# EAGLE design PickupBoard (EAGLE 7.4.0)
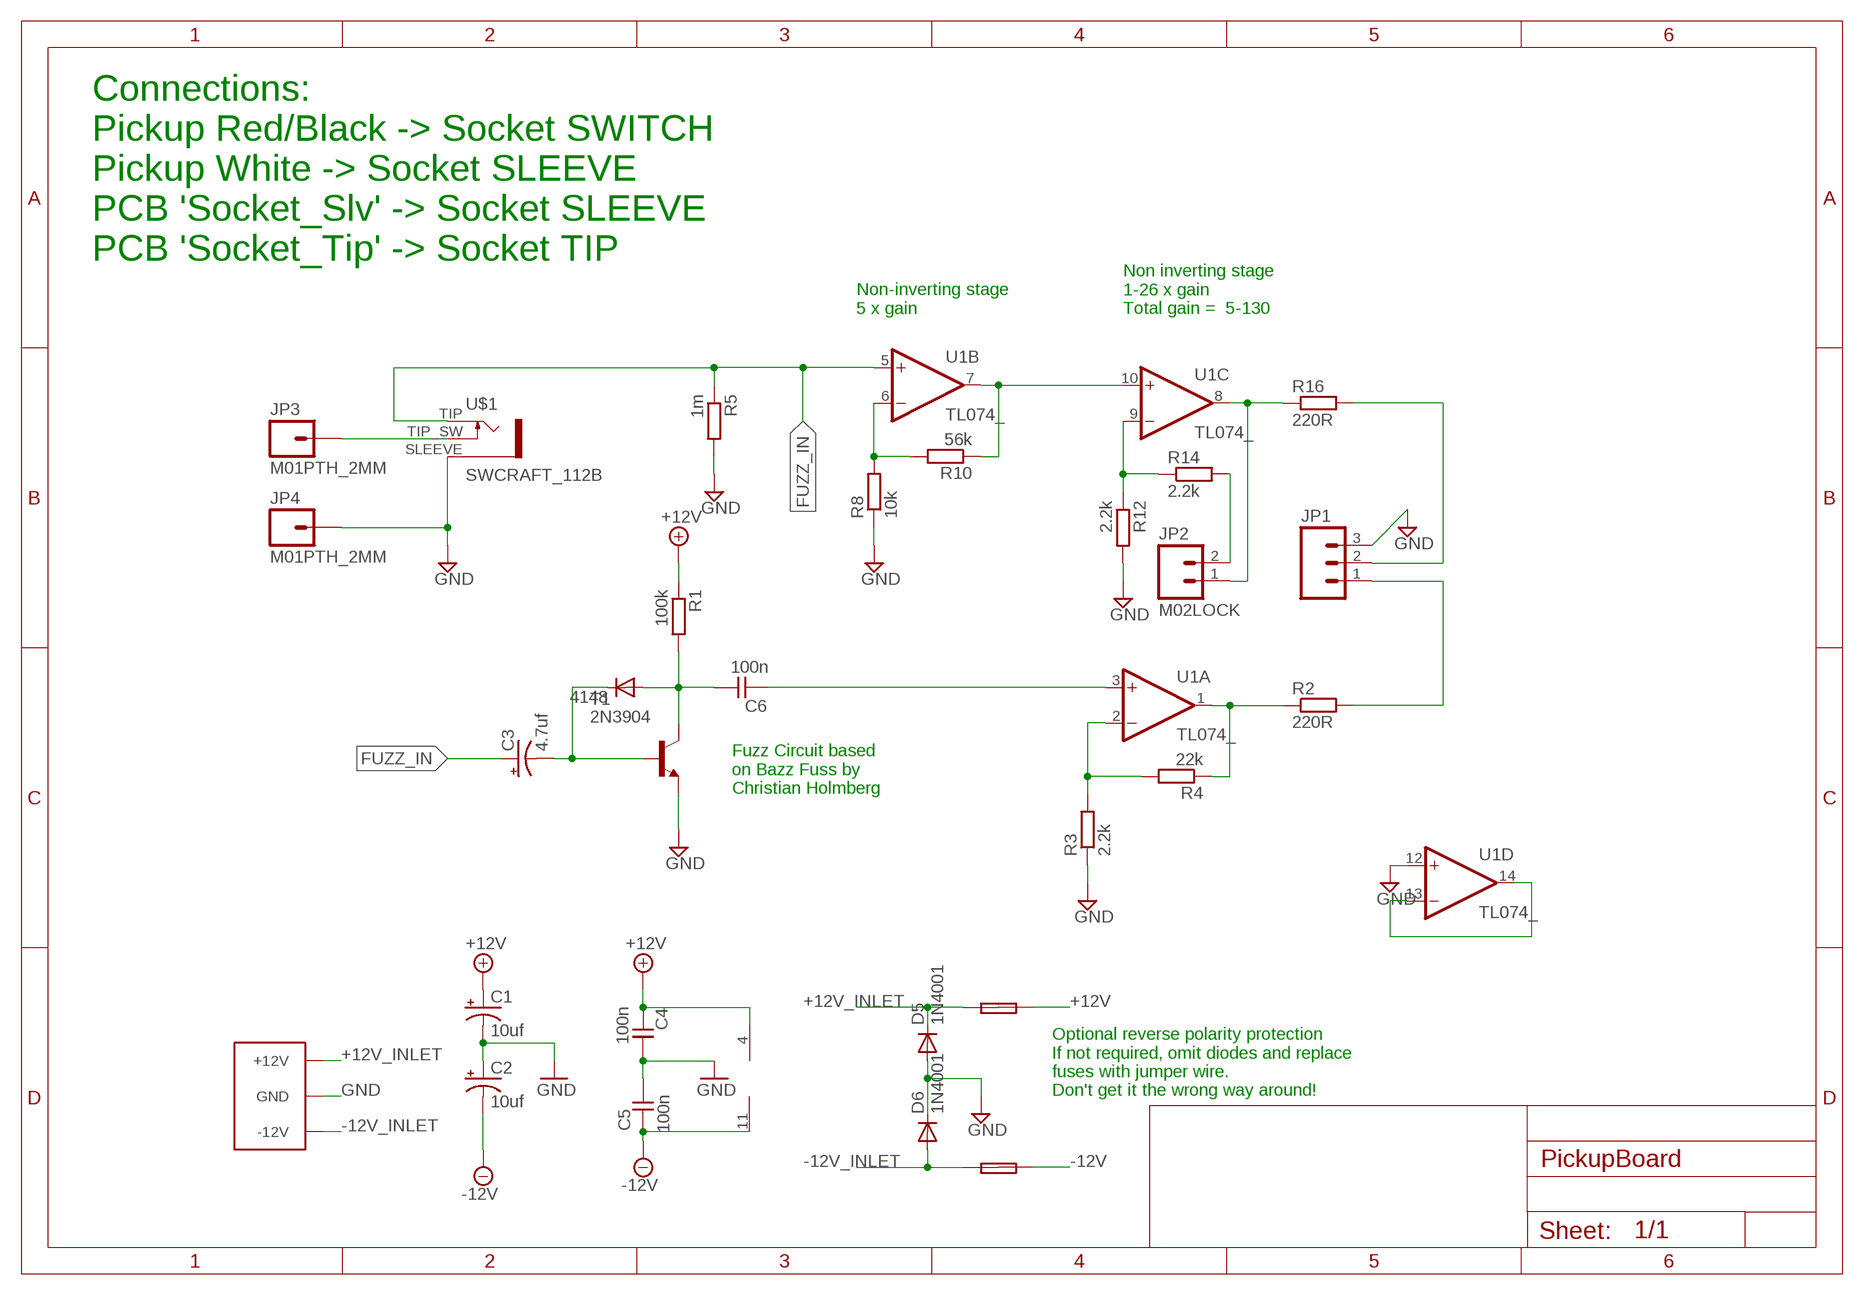
[diagram p0: schematic, sheet 1]

## Parts
1  FUSE  PTC_FUSEPOLY_FUSE  [C050H075X075]
4148  SMALL_DIODEDO35-7  [DO35-7]
C1  10uf  CAP_POLPTH2  [CPOL-RADIAL-10UF-25V]
C2  10uf  CAP_POLPTH2  [CPOL-RADIAL-10UF-25V]
C3  4.7uf  CAP_POLPTH2  [CPOL-RADIAL-10UF-25V]
C4  100n  C-EU050-024X044  [C050-024X044]
C5  100n  C-EU050-024X044  [C050-024X044]
C6  100n  C-EU050-024X044  [C050-024X044]
D5  1N4001  1N4004  [DO41-10]
D6  1N4001  1N4004  [DO41-10]
FUSE  FUSE  PTC_FUSEPOLY_FUSE  [C050H075X075]
JP1  M03LOCK  [1X03_LOCK]
JP2  M02LOCK  [1X02_LOCK]
JP3  M01PTH_2MM  [1X01_2MM]
JP4  M01PTH_2MM  [1X01_2MM]
R1  100k  RESISTOR7MM  [7MM_RESISTOR]
R2  220R  RESISTOR7MM  [7MM_RESISTOR]
R3  2.2k  RESISTOR7MM  [7MM_RESISTOR]
R4  22k  RESISTOR7MM  [7MM_RESISTOR]
R5  1m  RESISTOR7MM  [7MM_RESISTOR]
R8  10k  RESISTOR7MM  [7MM_RESISTOR]
R10  56k  RESISTOR7MM  [7MM_RESISTOR]
R12  2.2k  RESISTOR7MM  [7MM_RESISTOR]
R14  2.2k  RESISTOR7MM  [7MM_RESISTOR]
R16  220R  RESISTOR7MM  [7MM_RESISTOR]
T1  2N3904  [TO92]
U1  TL074_  [DIL14]
U$1  SWCRAFT_112B  [SWCRAFT_112_SLOTS]
U$2  EURO_POWER_LOCK  [EURO_PWR_HEADER_LOCK]

## Nets
+12V [power]: 1.2 C1.1(+) C4.2 R1.1 U1.4(P:V+)
+12V_INLET: 1.1 D5.C U$2.POS1(+12V) U$2.POS2(+12V)
-12V [power]: C2.2(-) C5.2 FUSE.2 U1.11(P:V-)
-12V_INLET: D6.A FUSE.1 U$2.NEG1(-12V) U$2.NEG2(-12V)
FUZZ_IN: C3.1(+) R5.1 U1.5(B:+IN) U$1.TIP
GND [ground]: C1.2(-) C2.1(+) C4.1 C5.1 D5.A D6.C JP1.3 JP4.1 R3.1 R5.2 R8.1 R12.2 T1.3(E) U1.12(D:+IN) U$1.SLEEVE U$2.GND1(GND) U$2.GND2(GND) U$2.GND3(GND) U$2.GND4(GND) U$2.GND5(GND) U$2.GND6(GND)
N$1: C6.2 U1.3(A:+IN)
N$2: U1.13(D:-IN) U1.14(D:OUT)
N$3: R8.2 R10.2 U1.6(B:-IN)
N$4: R10.1 U1.7(B:OUT) U1.10(C:+IN)
N$5: JP2.2 R14.2
N$6: R12.1 R14.1 U1.9(C:-IN)
N$7: 4148.C C3.2(-) T1.2(B)
N$8: JP2.1 R16.1 U1.8(C:OUT)
N$9: 4148.A C6.1 R1.2 T1.1(C)
N$10: JP1.2 R16.2
N$11: R3.2 R4.2 U1.2(A:-IN)
N$12: R2.1 R4.1 U1.1(A:OUT)
N$13: JP1.1 R2.2
N$14: JP3.1 U$1.TIP_SW

## Notes on the sheet
- Connections:
  Pickup Red/Black -> Socket SWITCH
  Pickup White -> Socket SLEEVE
  PCB 'Socket_Slv' -> Socket SLEEVE
  PCB 'Socket_Tip' -> Socket TIP
- Non-inverting stage
  5 x gain
- Non inverting stage
  1-26 x gain
  Total gain =  5-130
- Fuzz Circuit based 
  on Bazz Fuss by 
  Christian Holmberg
- Optional reverse polarity protection
  If not required, omit diodes and replace
  fuses with jumper wire. 
  Don't get it the wrong way around!

## Library data of the parts
1 FUSE = TomW:PTC_FUSE
4148 = MusicThingModular:SMALL_DIODE: Small Signal Diode
C1-C3 = SparkFun-Passives:CAP_POL: Capacitor Polarized These are standard SMD and PTH capacitors. Normally 10uF, 47uF, and 100uF in electrolytic and tantalum varieties. Always verify the external diameter of the through hole cap, it varies with capacity, voltage, and manufacturer. The EIA devices should be standard.
C4-C6 = TomW:C-EU: CAPACITOR, European symbol
D5 D6 = diode:1N4004: DIODE general purpose rectifier, 1 A
JP1 = SparkFun-Connectors:M03: Header 3 Standard 3-pin 0.1" header. Use with straight break away headers (SKU : PRT-00116), right angle break away headers (PRT-00553), swiss pins (PRT-00743), machine pins (PRT-00117), and female headers (PRT-00115). Molex polarized connector foot print use with SKU : PRT-08232 with associated crimp pins and housings.
JP2 = SparkFun-Connectors:M02: Standard 2-pin 0.1" header. Use with - straight break away headers ( PRT-00116) - right angle break away headers (PRT-00553) - swiss pins (PRT-00743) - machine pins (PRT-00117) - female headers (PRT-00115) Molex polarized connector foot print use with: PRT-08233 with associated crimp pins and housings. 2.54_SCREWTERM for use with PRT-10571. 3.5mm Screw Terminal footprints for PRT-08084 5mm Screw Terminal footprints for use with PRT-08433
JP3 JP4 = SparkFun-Connectors:M01: Header 1 Standard 1-pin 0.1" header. Use with straight break away headers (SKU : PRT-00116), right angle break away headers (PRT-00553), swiss pins (PRT-00743), machine pins (PRT-00117), and female headers (PRT-00115).
R1-R5 R8 R10 R12 R14 R16 = MusicThingModular:RESISTOR: Standard resistor, various versions
T1 = transistor:2N3904: NPN TRANSISTOR
U1 = MusicThingModular:TL074: Generic Quad Op Amp
U$1 = TomW:SWCRAFT_112B
U$2 = MusicThingModular:EURO_POWER_LOCK

## Net classes
0 default: width 0.254 mm
1 power: width 0.254 mm
2 ground: width 0.254 mm

## Board
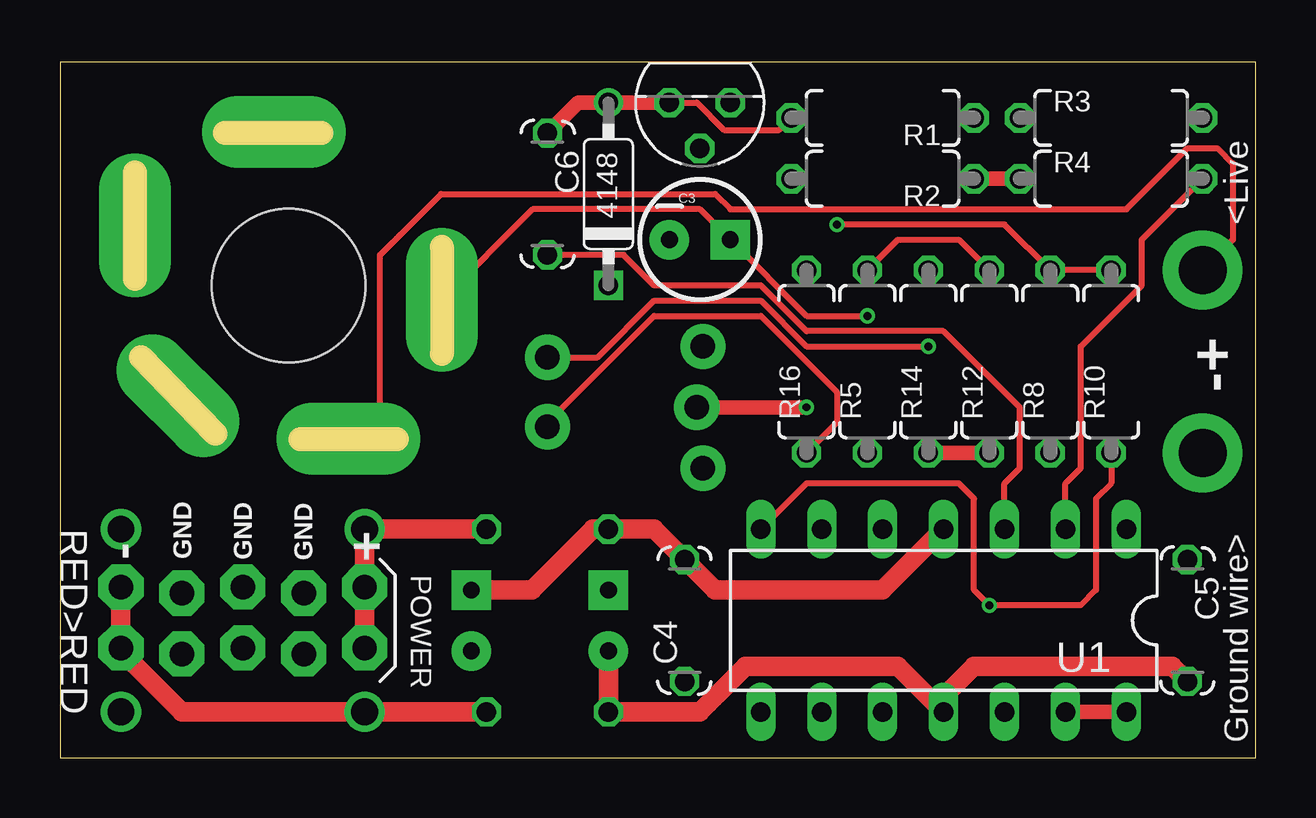
[diagram p1: board, top side]
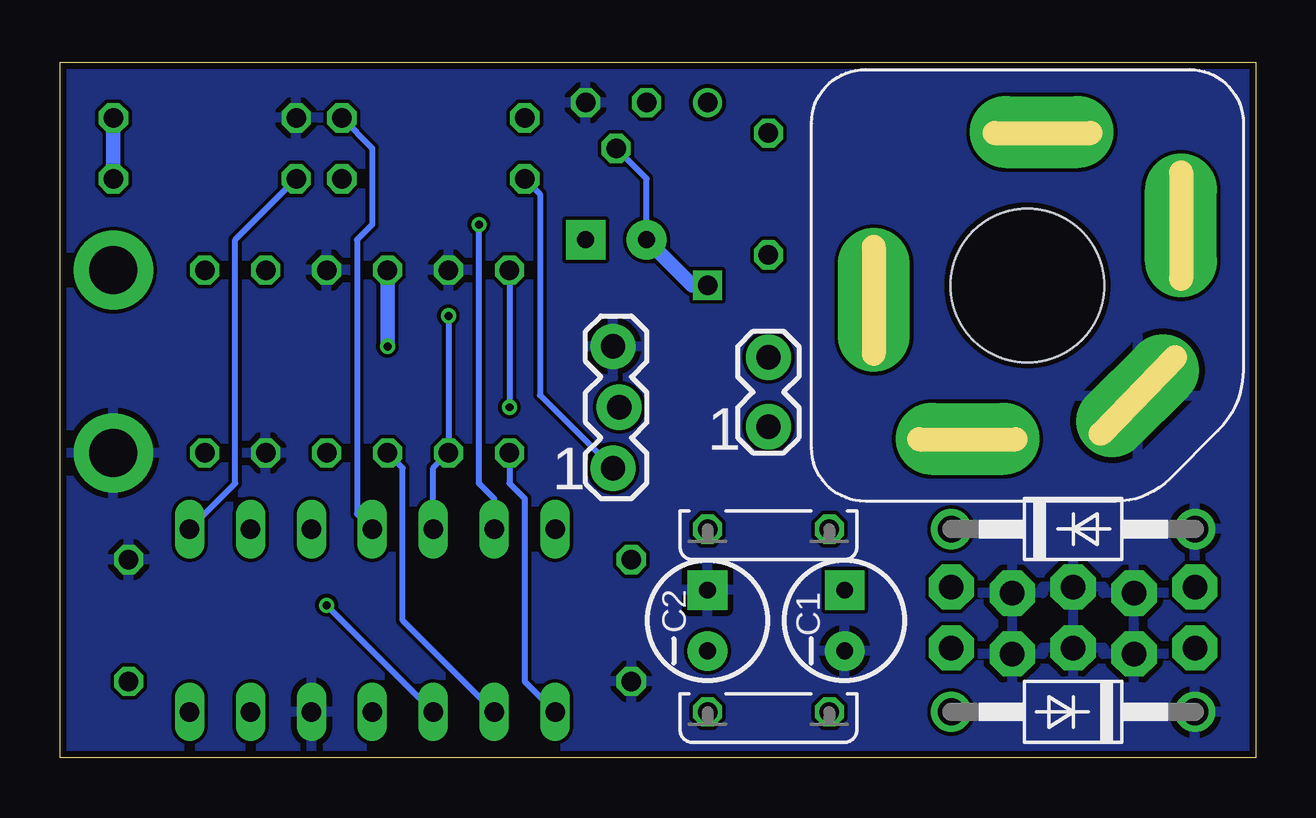
[diagram p2: board, bottom side, seen from below]

Size 49.85 x 29 mm. Coordinates in mm from the lower left corner, seen from the top.
Outline: 0,0 49.85,0 49.85,29 0,29 0,0
Copper layers (1*2*15*16): Top 0.035mm / dielectric 0.2mm / Route2 0.0175mm / dielectric 1.1mm / Route15 0.0175mm / dielectric 0.2mm / Bottom 0.035mm
Design rules "SeeedStudio_DRU_no_angle_20130527": minimum track width 6mil, minimum drill 12mil, track to track 6mil, track to pad 6mil, pad to pad 6mil, via to via 6mil, smd to smd 0mil, copper to edge 10mil, drill to drill 10mil, minimum pad ring 6mil, minimum via ring 6mil, stop-mask expansion 2mil, vias tented up to drill 25mil, thermal gap 10mil

### Footprints (pad centres in the part's own frame; a part is rotated, then mirrored left to right if it is on the bottom)
C050H075X075 = drill 0.813 octagon: 1 -2.54,0; 2 2.54,0
DO35-7 = drill 0.813: A 3.81,0 | drill 0.813 square: C -3.81,0
CPOL-RADIAL-10UF-25V = drill 0.7 pad 1.651 square: 1 1.27,0 | drill 0.7 pad 1.651: 2 -1.27,0
C050-024X044 = drill 0.813 octagon: 1 -2.54,0; 2 2.54,0
DO41-10 = drill 1.118: A 5.08,0; C -5.08,0
1X03_LOCK = drill 1.016 pad 1.88: 1 0,0.127; 2 2.54,-0.127; 3 5.08,0.127
1X02_LOCK = drill 1.016 pad 1.88: 1 -0.178,0; 2 2.718,0
1X01_2MM = drill 2 pad 3.302: 1 0,0
7MM_RESISTOR = drill 0.813 octagon: 1 -3.81,0; 2 3.81,0
TO92 = drill 0.813 octagon: 1 1.27,0; 2 0,1.905; 3 -1.27,0
DIL14 = drill 0.813 long: 1 -7.62,-3.81; 2 -5.08,-3.81; 3 -2.54,-3.81; 4 0,-3.81; 5 2.54,-3.81; 6 5.08,-3.81; 7 7.62,-3.81; 8 7.62,3.81; 9 5.08,3.81; 10 2.54,3.81; 11 0,3.81; 12 -2.54,3.81; 13 -5.08,3.81; 14 -7.62,3.81
SWCRAFT_112_SLOTS = drill 0.45 pad 3 long: RING 0.6,6.4; RING_SW 6.4,2.5; SLEEVE 4.6,-4.6; TIP -6.4,-0.6; TIP_SW -2.5,-6.4 | hole 6.4: 0,0
EURO_PWR_HEADER_LOCK = drill 1.016 pad 1.88 octagon: GND1 -2.54,1.143; GND2 -2.54,-1.397; GND3 0,1.397; GND4 0,-1.143; GND5 2.54,1.143; GND6 2.54,-1.397; NEG1 -5.08,1.397; NEG2 -5.08,-1.143; POS1 5.08,1.397; POS2 5.08,-1.143

### Placement (x,y rotation side)
1  20.32,9.53 180 bottom
4148  22.86,23.5 90 top
C1  17.14,5.71 90 bottom
C2  22.86,5.71 90 bottom
C3  26.67,21.59 0 top
C4  26.04,5.71 90 top
C5  46.99,5.71 270 top
C6  20.32,23.5 270 top
D5  7.62,9.53 0 bottom
D6  7.62,1.91 180 bottom
FUSE  20.32,1.91 180 bottom
JP1  26.67,12.06 90 bottom
JP2  20.32,13.97 90 bottom
JP3  47.62,20.32 0 top
JP4  47.62,12.7 0 top
R1  34.29,26.67 180 top
R2  34.29,24.13 180 top
R3  43.81,26.67 0 top
R4  43.81,24.13 0 top
R5  33.66,16.51 90 top
R8  41.27,16.51 90 top
R10  43.81,16.51 90 top
R12  38.73,16.51 90 top
R14  36.2,16.51 90 top
R16  31.11,16.51 90 top
T1  26.67,27.3 180 top
U1  36.83,5.71 180 top
U$1  9.53,19.68 0 bottom
U$2  7.62,5.71 0 top

### Tracks (layer width: path | path; a pad name or v marks a point on that pad's centre or on a via)
+12V
  Top 0.813: C1.1 19.68,6.99 22.23,9.53 1.2 24.77,9.53 C4.2 27.3,6.99 34.29,6.99 U1.4
  Bottom 0.254: R1.1 36.83,25.4 36.83,22.23 37.47,21.59 37.47,10.16 U1.4
+12V_INLET
  Top 0.813: U$2.POS2 U$2.POS1 D5.C 1.1
-12V
  Top 0.813: C2.2 FUSE.2 26.67,1.91 28.57,3.81 34.92,3.81 U1.11 36.83,2.54 38.1,3.81 46.35,3.81 C5.2
-12V_INLET
  Top 0.813: U$2.NEG1 U$2.NEG2 2.54,4.45 5.08,1.91 D6.A FUSE.1
FUZZ_IN  (via drill 0.33)
  Top 0.254: U$1.TIP 19.7,22.86 26.67,22.86 C3.1 31.11,18.41 v33.66,18.41
  Bottom 0.254: U1.5 34.29,12.06 R5.1 v33.66,18.41
GND
  Top 0.254: R5.2 34.92,21.59 37.47,21.59 R12.2
  pour Bottom: 0,28.89 0,0 66.15,-0.64 66.15,28.89
N$1
  Top 0.254: U1.3 39.37,11.43 40.01,12.06 40.01,14.61 36.83,17.78 31.11,17.78 29.21,19.68 24.77,19.68 23.5,20.95 C6.2
N$2
  Top 0.61: U1.13 U1.14
N$3  (via drill 0.33)
  Top 0.254: R10.2 R8.2 39.37,22.23 v32.38,22.23
  Bottom 0.254: U1.6 31.75,10.79 32.38,11.43 v32.38,22.23
N$4  (via drill 0.33)
  Top 0.254: R10.1 43.81,11.43 43.18,10.79 43.18,6.99 42.55,6.35 v38.73,6.35 38.1,6.99 38.1,10.79 37.47,11.43 31.11,11.43 U1.7
  Bottom 0.254: U1.10 v38.73,6.35
N$5  (via drill 0.33)
  Top 0.254: JP2.2 22.4,16.69 24.77,19.05 29.21,19.05 31.11,17.14 v36.2,17.14
  Bottom 0.61: v36.2,17.14 R14.2
N$6
  Top 0.61: R14.1 R12.1
  Bottom 0.254: U1.9 35.56,5.71 35.56,12.06 R14.1
N$7
  Bottom 0.254: C3.2 25.4,24.13 T1.2
  Bottom 0.61: 4148.C 23.5,19.68 C3.2
N$8
  Top 0.254: JP2.1 20.32,13.97 24.77,18.41 29.21,18.41 32.38,15.24 32.38,13.97 R16.1
  Bottom 0.254: R16.1 31.11,11.43 30.48,10.79 30.48,3.17 U1.8
N$9
  Top 0.254: T1.1 26.54,27.3 27.69,26.16 29.97,26.16 R1.2
  Top 0.61: C6.1 21.59,27.3 4148.A T1.1
N$10  (via drill 0.33)
  Top 0.61: JP1.2 v31.11,14.61
  Bottom 0.254: R16.2 v31.11,14.61
N$11
  Top 0.254: U1.2 41.91,11.43 42.55,12.06 42.55,17.14 45.09,19.68 45.09,21.59 R4.2
  Bottom 0.61: R3.2 R4.2
N$12
  Top 0.61: R2.1 R4.1
  Bottom 0.254: U1.1 42.55,11.43 42.55,21.59 R4.1
N$13
  Bottom 0.254: R2.2 29.84,23.5 29.84,15.11 JP1.1
N$14
  Top 0.254: U$1.TIP_SW 12.03,13.29 13.34,14.61 13.34,20.95 15.88,23.5 27.3,23.5 27.94,22.86 44.45,22.86 46.99,25.4 48.26,25.4 48.9,24.77 48.9,21.59 JP3.1

### Text on the board
tPlace: Music Thing Modular Pickup / Designed in Herne Hill, London / by Tom Whitwell PCB Rev 1 / September 2015 | CC-BY-SA | <Live | -+ | Ground wire>
bPlace: Wiring: / PU Black Wire AND / PCB 'SLEEVE' to / 1/4" Socket SLEEVE | Wiring: / PU Not Black wire / AND PCB TIP to / 1/4" Socket TIP | 1 | 1